# Altium schematic sheet Ethernet.SchDoc
size B; DocumentNumber: 8; SheetNumber: 8; SheetTotal: 13
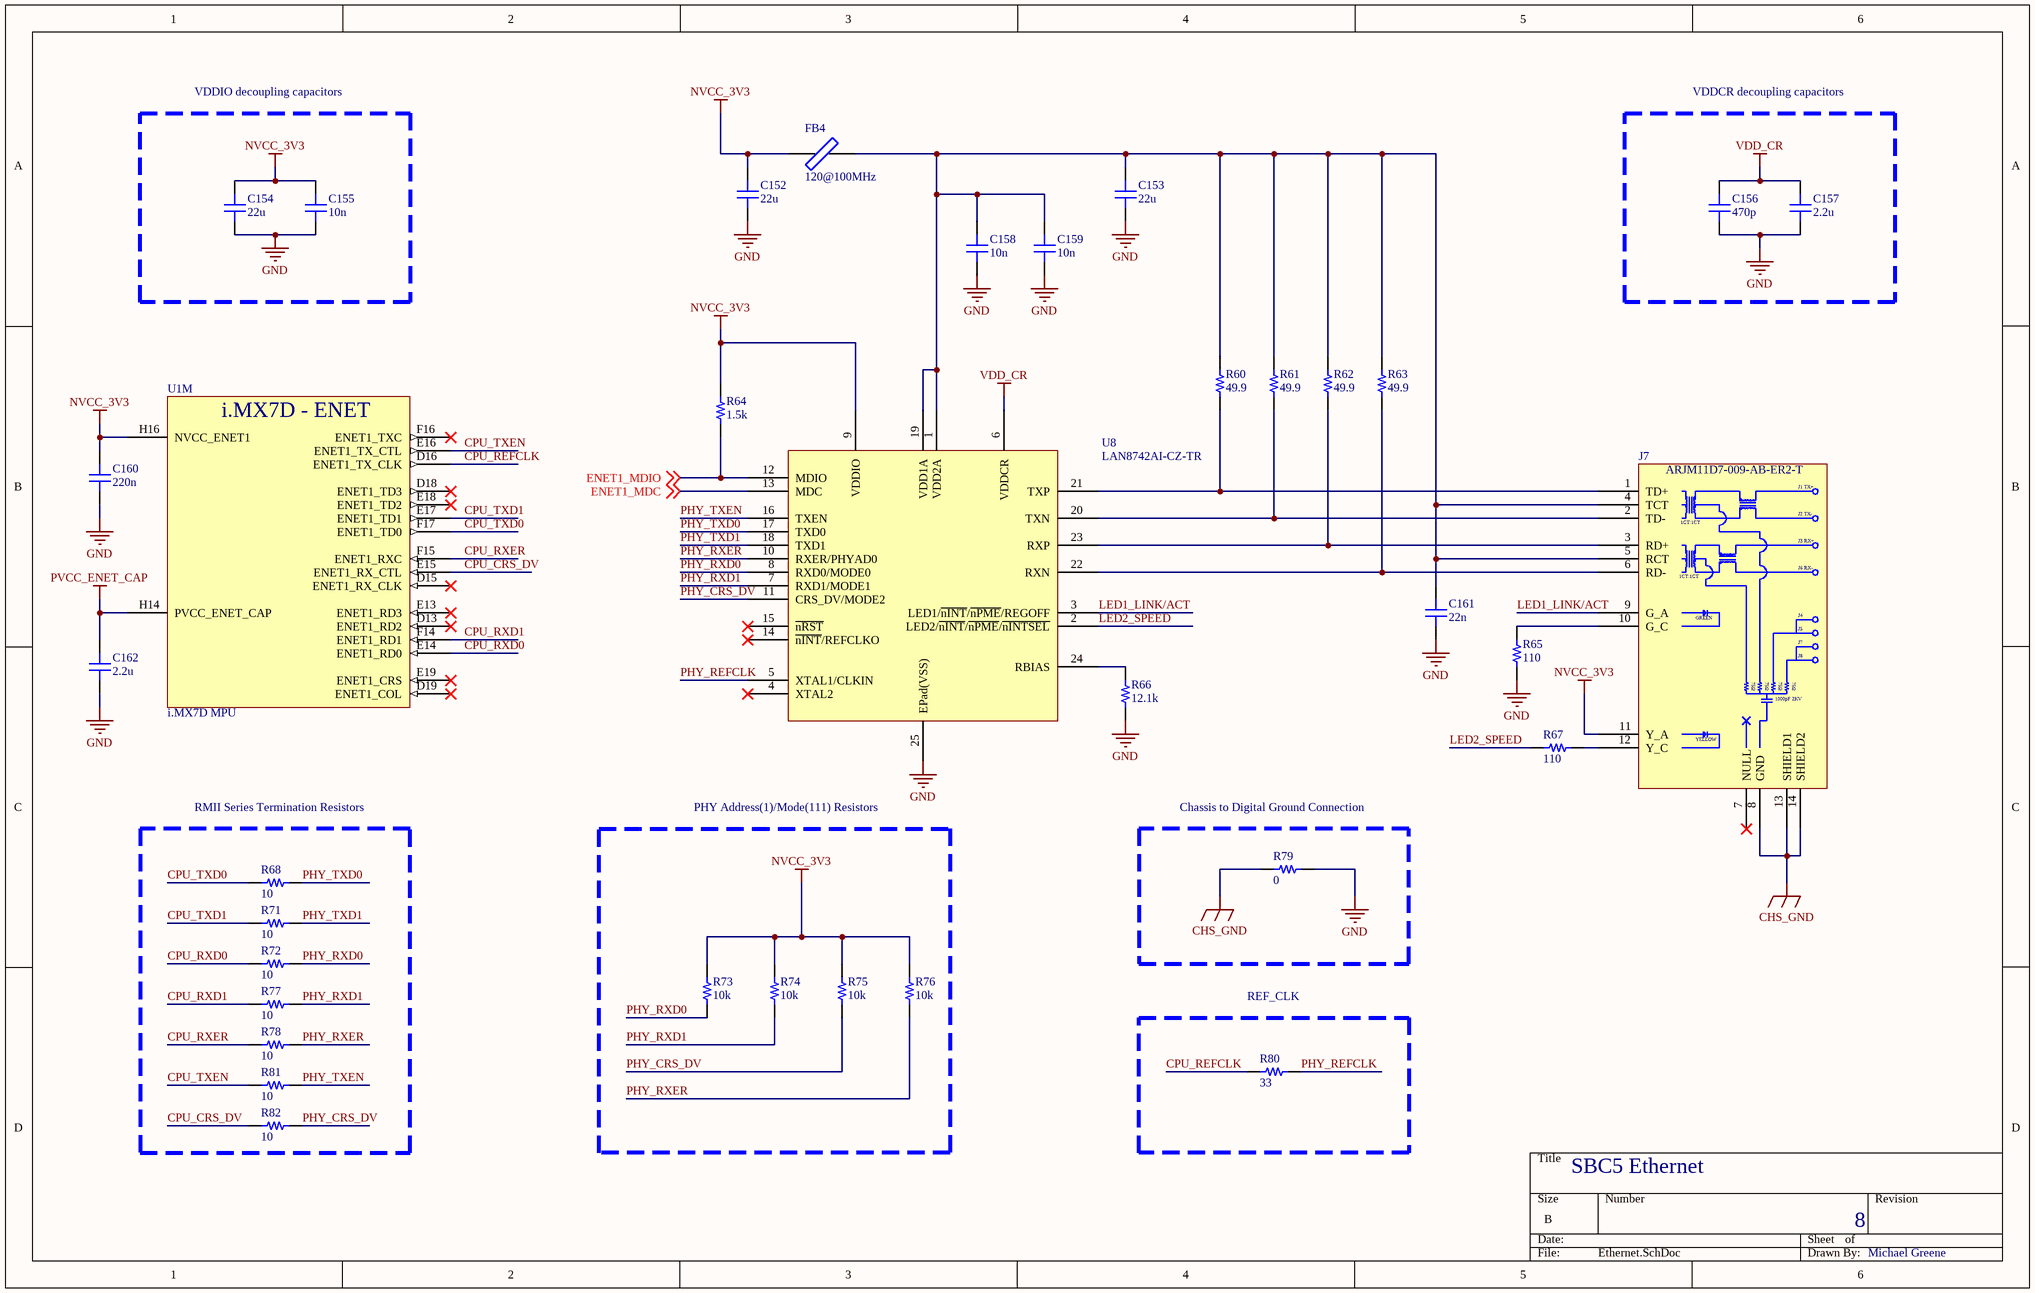
[diagram p0: Ethernet.SchDoc]

## Parts
C152  22u  [C0603]
C153  22u  [C0603]
C154  22u  [C0603]
C155  10n  [C0402]
C156  470p  [C0402]
C157  2.2u  [C0402]
C158  10n  [C0402]
C159  10n  [C0402]
C160  220n  [C0201]
C161  22n  [C0402]
C162  2.2u  [C0402]
FB4  120@100MHz  [L0402]
J7  ARJM11D7-009-AB-ER2-T  [ARJM11D7-009-AB-ER2-T]
R60  49.9  [R0402]
R61  49.9  [R0402]
R62  49.9  [R0402]
R63  49.9  [R0402]
R64  1.5k  [R0402]
R65  110  [R0402]
R66  12.1k  [R0402]
R67  110  [R0402]
R68  10  [R0402]
R71  10  [R0402]
R72  10  [R0402]
R73  10k  [R0201]
R74  10k  [R0201]
R75  10k  [R0201]
R76  10k  [R0201]
R77  10  [R0402]
R78  10  [R0402]
R79  0  [R1210]
R80  33  [R0402]
R81  10  [R0402]
R82  10  [R0402]
U1  i.MX7D MPU  [BGA541C75P25X25_1900X1900X140]  (part M of 23)
U8  LAN8742AI-CZ-TR  [LAN8742AI-CZ-TR-ND]

## Blocks framed on the sheet
VDDIO decoupling capacitors: C154 C155
VDDCR decoupling capacitors: C156 C157
RMII Series Termination Resistors: R68 R71 R72 R77 R78 R81 R82
PHY Address(1)/Mode(111) Resistors: R73-R76
Chassis to Digital Ground Connection: R79
REF_CLK: R80

## Nets
CHS_GND: J7.8(GND) J7.13(SHIELD1) J7.14(SHIELD2) R79.1
GND: C152.1 C153.1 C154.1 C155.1 C156.1 C157.1 C158.2 C159.1 C160.1 C161.1 C162.1 R65.1 R66.1 R79.2 U8.25(EPad(VSS))
NVCC_3V3: C152.2 C154.2 C155.2 C160.2 FB4.1 J7.11(Y_A) R64.2 R73.2 R74.2 R75.2 R76.2 U1.H16(NVCC_ENET1) U8.9(VDDIO)
PVCC_ENET_CAP: C162.2 U1.H14(PVCC_ENET_CAP)
VDD_CR: C156.2 C157.2 U8.6(VDDCR)
CPU_CRS_DV: R82.1 U1.E15(ENET1_RX_CTL)
CPU_REFCLK: R80.1 U1.D16(ENET1_TX_CLK)
CPU_RXD0: R72.1 U1.E14(ENET1_RD0)
CPU_RXD1: R77.1 U1.F14(ENET1_RD1)
CPU_RXER: R78.1 U1.F15(ENET1_RXC)
CPU_TXD0: R68.1 U1.F17(ENET1_TD0)
CPU_TXD1: R71.1 U1.E17(ENET1_TD1)
CPU_TXEN: R81.1 U1.E16(ENET1_TX_CTL)
ENET1_MDC: U8.13(MDC) ; off-sheet ENET1_MDC
ENET1_MDIO: R64.1 U8.12(MDIO) ; off-sheet ENET1_MDIO
LED1_LINK/ACT: J7.9(G_A) U8.3(LED1/~{nINT}/~{nPME}/REGOFF)
LED2_SPEED: R67.1 U8.2(LED2/~{nINT}/~{nPME}/~{nINTSEL})
PHY_CRS_DV: R75.1 R82.2 U8.11(CRS_DV/MODE2)
PHY_REFCLK: R80.2 U8.5(XTAL1/CLKIN)
PHY_RXD0: R72.2 R73.1 U8.8(RXD0/MODE0)
PHY_RXD1: R74.1 R77.2 U8.7(RXD1/MODE1)
PHY_RXER: R76.1 R78.2 U8.10(RXER/PHYAD0)
PHY_TXD0: R68.2 U8.17(TXD0)
PHY_TXD1: R71.2 U8.18(TXD1)
PHY_TXEN: R81.2 U8.16(TXEN)
NetC153_2: C153.2 C158.1 C159.2 C161.2 FB4.2 J7.4(TCT) J7.5(RCT) R60.2 R61.2 R62.2 R63.2 U8.1(VDD2A) U8.19(VDD1A)
NetJ7_1: J7.1(TD+) R60.1 U8.21(TXP)
NetJ7_2: J7.2(TD-) R61.1 U8.20(TXN)
NetJ7_3: J7.3(RD+) R62.1 U8.23(RXP)
NetJ7_6: J7.6(RD-) R63.1 U8.22(RXN)
NetJ7_10: J7.10(G_C) R65.2
NetJ7_12: J7.12(Y_C) R67.2
NetR66_2: R66.2 U8.24(RBIAS)

Not connected (* = marked no-connect by the designer): J7 7(NULL)*; U1 D13(ENET1_RD2)* D15(ENET1_RX_CLK)* D18(ENET1_TD3)* D19(ENET1_COL)* E13(ENET1_RD3)* E18(ENET1_TD2)* E19(ENET1_CRS)* F16(ENET1_TXC)*; U8 4(XTAL2)* 14(~{nINT}/REFCLKO)* 15(~{nRST})*

## Notes on the sheet
- SBC5 Ethernet
- 8
- Michael Greene
- (in symbol ARJM11D7-009-AB-ER2-T) J1 TX+; J2 TX-; 1CT:1CT; J3 RX+; J6 RX-; GREEN; J4; J5; J8; 75Ω; 1000pF 2KV; YELLOW
- (in symbol MCIMX7D2DVM12SD, part M) i.MX7D - ENET

## Library data of the parts
C152-C154 = GRM188R61A226ME15D: 0603 22 uF 10 V ±20% Tolerance X5R Multilayer Ceramic Chip Capacitor; Manufacturer: Murata; Capacitance: 22uF; Voltage Rating: 10V; Supplier 1: Digi-Key; Manufacturer Part Number: GRM188R61A226ME15D; RoHS: Yes; Category: Ceramic Capacitors; Stock 1: 1418007; Pricing 1: 1=0.30000, 10=0.20500, 50=0.13680, 100=0.11630, 500=0.08210, 1000=0.07184 (USD); Mount: Surface Mount; Case/Package: 0603; Case Code (Metric): 1608; Case Code (Imperial): 0603; Material: Ceramic; Weight: 0.000222oz; Min Operating Temperature: -55°C; Max Operating Temperature: 85°C; Tolerance: 20%; Packaging: Tape and Reel; Dielectric: X5R; Termination: SMD/SMT; Voltage Rating (DC): 10V; Package Quantity: 4000; Length: 1.6mm; Width: 0.8mm; Height: 0.8mm; Thickness: 0.039inch; Depth: 0.8mm; REACH SVHC: No SVHC; Lead Free: Lead Free; ComponentLink1URL: https://datasheet.ciiva.com/46444/1769893-46444975.pdf?src-supplier=Element14; ComponentLink1Description: https://datasheet.ciiva.com/46444/1769893-46444975.pdf?src-supplier=Element14; Supplier Part Number 1: 490-10476-1-ND
C155 C158 C159 = CL05B103KO5NNNC: SAMSUNG ELECTRO-MECHANICS - CL05B103KO5NNNC - SMD Multilayer Ceramic Capacitor, 0.01 µF, 16 V, 0402 [1005 Metric], ± 10%, X7R, CL Series; Capacitance: 10nF; Voltage Rating: 16V; Supplier 1: Digi-Key; Supplier Part Number 1: 1276-1051-1-ND; Manufacturer: Samsung; Manufacturer Part Number: CL05B103KO5NNNC; RoHS: Yes; Category: Ceramic Capacitors; Stock 1: 2979671; Pricing 1: 1=0.10000, 10=0.01600, 50=0.00880, 100=0.00710, 500=0.00508, 1000=0.00399, 2500=0.00363, 5000=0.00334 (USD); Mount: Surface Mount; Case/Package: 0402; Case Code (Metric): 1005; Case Code (Imperial): 0402; Material: Ceramic; Min Operating Temperature: -55°C; Max Operating Temperature: 125°C; Tolerance: 10%; Dielectric: X7R; Package Quantity: 1; Packaging: Tape and Reel; Voltage: 16V; Series: CL; Construction: Flat; Length: 1mm; Width: 0.02inch; Height: 0.5mm; Thickness: 0.022inch; Depth: 0.5mm; Radiation Hardening: No; RoHS Compliant: Yes; ComponentLink1URL: https://datasheet.ciiva.com/16199/cl05b103ko5nnnc-16199040.pdf?src-supplier=Future+Electronics; ComponentLink1Description: https://datasheet.ciiva.com/16199/cl05b103ko5nnnc-16199040.pdf?src-supplier=Future+Electronics; ComponentLink2URL: https://datasheet.ciiva.com/15195/getdatasheetpartid-358673-15195638.pdf?src-supplier=Verical; ComponentLink2Description: https://datasheet.ciiva.com/15195/getdatasheetpartid-358673-15195638.pdf?src-supplier=Verical; ComponentLink3URL: https://datasheet.ciiva.com/29198/458774-da-01-en-vs-kondensator-0402-29198435.pdf?src-supplier=Conrad; ComponentLink3Description: https://datasheet.ciiva.com/29198/458774-da-01-en-vs-kondensator-0402-29198435.pdf?src-supplier=Conrad; ComponentLink4URL: https://datasheet.ciiva.com/25806/cl05b103ko5nnnc-25806933.pdf?src-supplier=Digi-Key; ComponentLink4Description: https://datasheet.ciiva.com/25806/cl05b103ko5nnnc-25806933.pdf?src-supplier=Digi-Key
C156 = GRM1555C1H471JA01J: Multilayer Ceramic Capacitors MLCC - SMD/SMT 470pF 50Volts C0G 5%; Manufacturer: Murata; Voltage Rating: 50V; Supplier 1: Digi-Key; Supplier Part Number 1: 490-6242-1-ND; Manufacturer Part Number: GRM1555C1H471JA01J; RoHS: Yes; Category: Ceramic Capacitors; Stock 1: 130204; Pricing 1: 1=0.10000, 10=0.07100, 50=0.03900, 100=0.03180, 500=0.02272, 1000=0.01785, 2500=0.01622, 5000=0.01493 (USD); Mount: Surface Mount; Case/Package: 0402; Case Code (Metric): 1005; Case Code (Imperial): 0402; Min Operating Temperature: -55°C; Max Operating Temperature: 125°C; Capacitance: 470pF; Tolerance: 5%; Package Quantity: 50000; Packaging: Tape and Reel; Dielectric: C0G; Termination: SMD/SMT; Voltage: 50V; Voltage Rating (DC): 50V; Length: 1mm; Width: 0.02inch; Height: 0.5mm; Thickness: 0.022inch; Depth: 0.5mm; Radiation Hardening: No; Lead Free: Lead Free; ComponentLink1URL: https://datasheet.ciiva.com/6270/product-6270772.pdf?src-supplier=Digi-Key; ComponentLink1Description: https://datasheet.ciiva.com/6270/product-6270772.pdf?src-supplier=Digi-Key; ComponentLink2URL: https://datasheet.ciiva.com/6270/partnumbering-e-01-6270773.pdf?src-supplier=Digi-Key; ComponentLink2Description: https://datasheet.ciiva.com/6270/partnumbering-e-01-6270773.pdf?src-supplier=Digi-Key; ComponentLink3URL: https://datasheet.ciiva.com/6270/partnumbering-e-01-6270774.pdf?src-supplier=Digi-Key; ComponentLink3Description: https://datasheet.ciiva.com/6270/partnumbering-e-01-6270774.pdf?src-supplier=Digi-Key; ComponentLink4URL: https://datasheet.ciiva.com/11604/product-11604839.pdf?src-supplier=Avnet; ComponentLink4Description: https://datasheet.ciiva.com/11604/product-11604839.pdf?src-supplier=Avnet
C157 C162 = LMK105BJ225MV-F: TAIYO YUDEN         LMK105BJ225MV-F            CERAMIC CAPACITOR, 2.2UF, 10V, X5R, 20%, 0402; Supplier 1: Digi-Key; Manufacturer: Taiyo Yuden; Manufacturer Part Number: LMK105BJ225MV-F; RoHS: Yes; Category: Ceramic Capacitors; Stock 1: 422093; Pricing 1: 1=0.10000, 10=0.05800, 50=0.03160, 100=0.02590, 500=0.01848, 1000=0.01452, 2500=0.01320, 5000=0.01214 (USD); Mount: Surface Mount; Case/Package: 0402; Case Code (Imperial): 0402; Case Code (Metric): 1005; Min Operating Temperature: -55°C; Max Operating Temperature: 85°C; Termination: SMD/SMT; Packaging: Tape and Reel; Capacitance: 2.2uF; Tolerance: 20%; Voltage Rating: 10V; Package Quantity: 1; Voltage Rating (DC): 10V; Dielectric: X5R; Resistor Type: Ceramic; Length: 1mm; Width: 0.5mm; Height: 0.5mm; Thickness: 0.022inch; Depth: 0.5mm; Radiation Hardening: No; Halogen Free: Halogen Free; REACH SVHC: Unknown; ComponentLink1URL: https://datasheet.ciiva.com/30190/500lmk105bj225mv-f-30190498.pdf?src-supplier=Onlinecomponents.com; ComponentLink1Description: https://datasheet.ciiva.com/30190/500lmk105bj225mv-f-30190498.pdf?src-supplier=Onlinecomponents.com; ComponentLink2URL: https://datasheet.ciiva.com/23631/lmk105bj225mv-f-ss-23631491.pdf?src-supplier=Newark; ComponentLink2Description: https://datasheet.ciiva.com/23631/lmk105bj225mv-f-ss-23631491.pdf?src-supplier=Newark; ComponentLink3URL: https://datasheet.ciiva.com/134/lmk105bj225mv-f-ss-134677.pdf?src-supplier=Digi-Key; ComponentLink3Description: https://datasheet.ciiva.com/134/lmk105bj225mv-f-ss-134677.pdf?src-supplier=Digi-Key; ComponentLink4URL: https://datasheet.ciiva.com/15921/286lmk105bj225mv-f-15921222.pdf?src-supplier=Onlinecomponents.com; ComponentLink4Description: https://datasheet.ciiva.com/15921/286lmk105bj225mv-f-15921222.pdf?src-supplier=Onlinecomponents.com; Supplier Part Number 1: 587-3153-1-ND
C160 = GRM033R61C224KE14D: Cap Ceramic Monolithic 0.22uF 16VDC 10% SMD Paper T/R; Manufacturer: Murata; Supplier 1: Digi-Key; Manufacturer Part Number: GRM033R61C224KE14D; RoHS: No; Stock 1: 16192; Pricing 1: 1=0.10000, 10=0.03900, 50=0.02120, 100=0.01720, 500=0.01232, 1000=0.00968, 2500=0.00880, 5000=0.00810 (USD); ComponentLink1URL: https://search.murata.co.jp/Ceramy/image/img/A01X/G101/ENG/GRM033R61C224KE14-01.pdf?src-supplier=Digi-Key; ComponentLink1Description: https://search.murata.co.jp/Ceramy/image/img/A01X/G101/ENG/GRM033R61C224KE14-01.pdf?src-supplier=Digi-Key; Supplier Part Number 1: 490-17040-1-ND
C161 = GRM155R71H223KA12J: Multilayer Ceramic Capacitors MLCC - SMD/SMT 0.022uF 50Volts X7R 10%; Manufacturer: Murata; Capacitance: 22nF; Voltage Rating: 50V; Supplier 1: Digi-Key; Supplier Part Number 1: 490-6360-1-ND; Manufacturer Part Number: GRM155R71H223KA12J; RoHS: Yes; Category: Ceramic Capacitors; Stock 1: 8911; Pricing 1: 1=0.10000, 10=0.04300, 50=0.02320, 100=0.01900, 500=0.01356, 1000=0.01065, 2500=0.00968, 5000=0.00891 (USD); Mount: Surface Mount; Case/Package: 0402; Case Code (Imperial): 0402; Case Code (Metric): 1005; Min Operating Temperature: -55°C; Max Operating Temperature: 125°C; Voltage Rating (DC): 50V; Tolerance: 10%; Packaging: Tape and Reel; Package Quantity: 50000; Dielectric: X7R; Termination: SMD/SMT; Voltage: 50V; Length: 1mm; Width: 0.5mm; Height: 0.5mm; Thickness: 0.022inch; Depth: 0.5mm; Radiation Hardening: No; Lead Free: Lead Free; ComponentLink1URL: https://datasheet.ciiva.com/5421/product-5421874.pdf?src-supplier=Mouser; ComponentLink1Description: https://datasheet.ciiva.com/5421/product-5421874.pdf?src-supplier=Mouser; ComponentLink2URL: https://datasheet.ciiva.com/6271/partnumbering-e-01-6271031.pdf?src-supplier=Digi-Key; ComponentLink2Description: https://datasheet.ciiva.com/6271/partnumbering-e-01-6271031.pdf?src-supplier=Digi-Key; ComponentLink3URL: https://datasheet.ciiva.com/11619/product-11619562.pdf?src-supplier=Avnet; ComponentLink3Description: https://datasheet.ciiva.com/11619/product-11619562.pdf?src-supplier=Avnet; ComponentLink4URL: https://datasheet.ciiva.com/6271/partnumbering-e-01-6271033.pdf?src-supplier=Digi-Key; ComponentLink4Description: https://datasheet.ciiva.com/6271/partnumbering-e-01-6271033.pdf?src-supplier=Digi-Key; ComponentLink5URL: https://datasheet.ciiva.com/6271/partnumbering-e-01-6271036.pdf?src-supplier=Digi-Key; ComponentLink5Description: https://datasheet.ciiva.com/6271/partnumbering-e-01-6271036.pdf?src-supplier=Digi-Key
FB4 = BLM15PD121SN1D: MURATA - BLM15PD121SN1D - Ferrite Bead, 0402 [1005 Metric], 120 ohm, 1.3 A, BLM15PD Series, 0.09 ohm, ± 25%; Material: Steel,Ferrite; Impedance: 120R; DC Resistance (DCR): 90mR; Max DC Current: 1.3A; Number of Lines: 1; Test Frequency: 100MHz; Supplier 1: Digi-Key; Supplier Part Number 1: 490-5203-1-ND; Manufacturer: Murata; Manufacturer Part Number: BLM15PD121SN1D; RoHS: Yes; Category: Inductors; Stock 1: 519984; Pricing 1: 1=0.10000, 10=0.07900, 25=0.07080, 50=0.05180, 100=0.04480, 250=0.03536, 500=0.02984, 1000=0.02514, 5000=0.02239 (USD); Case/Package: 0402; Number of Pins: 2; Core Material: Ferrite; Case Code (Metric): 1005; Case Code (Imperial): 0402; Min Operating Temperature: -55°C; Max Operating Temperature: 125°C; Tolerance: 25%; Package Quantity: 1; Packaging: Tape and Reel; Current Rating: 1.3A; Max Current Rating: 1.3A; Termination: SMD/SMT; DC Current: 1.3A; Number of Circuits: 1; Series: BLM15PD; DC Resistance-Max: 90mR; Length: 1mm; Width: 0.5mm; Height: 0.5mm; Depth: 0.55mm; Radiation Hardening: No; REACH SVHC: No SVHC; Military Standard: Not; Lead Free: Lead Free; RoHS Compliant: Yes; ComponentLink1URL: https://datasheet.ciiva.com/18093/getdatasheetpartid-195858-18093157.pdf?src-supplier=Verical; ComponentLink1Description: https://datasheet.ciiva.com/18093/getdatasheetpartid-195858-18093157.pdf?src-supplier=Verical; ComponentLink2URL: https://datasheet.ciiva.com/11800/0900766b811b5866-11800860.pdf?src-supplier=RSComponents; ComponentLink2Description: https://datasheet.ciiva.com/11800/0900766b811b5866-11800860.pdf?src-supplier=RSComponents; ComponentLink3URL: https://datasheet.ciiva.com/41425/001171686-da-01-en-chip-drossel0402-120r-1300ma-1-0x0-5mm-41425776.pdf?src-supplier=Conrad; ComponentLink3Description: https://datasheet.ciiva.com/41425/001171686-da-01-en-chip-drossel0402-120r-1300ma-1-0x0-5mm-41425776.pdf?src-supplier=Conrad; ComponentLink4URL: https://datasheet.ciiva.com/41449/001172205-da-01-en-drossel-0402-120r-11-0x0-5mm-10000st-41449495.pdf?src-supplier=Conrad; ComponentLink4Description: https://datasheet.ciiva.com/41449/001172205-da-01-en-drossel-0402-120r-11-0x0-5mm-10000st-41449495.pdf?src-supplier=Conrad; ComponentLink5URL: https://datasheet.ciiva.com/1012/l0110e-1012434.pdf?src-supplier=Digi-Key; ComponentLink5Description: https://datasheet.ciiva.com/1012/l0110e-1012434.pdf?src-supplier=Digi-Key; ComponentLink6URL: https://datasheet.ciiva.com/1012/l0110e-1012435.pdf?src-supplier=Digi-Key; ComponentLink6Description: https://datasheet.ciiva.com/1012/l0110e-1012435.pdf?src-supplier=Digi-Key; ComponentLink7URL: https://datasheet.ciiva.com/1012/l0110e-1012436.pdf?src-supplier=Digi-Key; ComponentLink7Description: https://datasheet.ciiva.com/1012/l0110e-1012436.pdf?src-supplier=Digi-Key
J7 = ARJM11D7-009-AB-ER2-T: Conn RJ-45 F 8 POS 1.27mm Solder RA Thru-Hole 12 Terminal 1 Port T/R; Manufacturer: Abracon; Connector Type: RJ45; Direction: Up; Number of Ports: 1; Number of Cores per Jack: 4; Shielding: Shielded; Supplier 1: Digi-Key; Supplier Part Number 1: 535-14135-1-ND; Manufacturer Part Number: ARJM11D7-009-AB-ER2-T; RoHS: No; Category: Modular / Ethernet Connectors; Stock 1: 19; Pricing 1: 1=3.53000, 10=3.38700, 25=3.10480 (USD); Mount: Through Hole; Color: Green,Yellow; Contact Plating: Gold; Min Operating Temperature: -40°C; Max Operating Temperature: 85°C; Packaging: Tape and Reel; Number of Rows: 1; Termination: Solder; ComponentLink1URL: https://abracon.com/Magnetics/ARJM11.pdf?src-supplier=Digi-Key; ComponentLink1Description: https://abracon.com/Magnetics/ARJM11.pdf?src-supplier=Digi-Key
R60-R63 = MCS04020C4999FE000: RES SMD 49.9 OHM 1% 1/10W 0402; Manufacturer: Vishay BCcomponents; Temperature Coefficient: 50ppm/°C; Resistance: 49.9R; Max Power Dissipation: 100mW; Power Rating: 63mW; Voltage Rating: 50V; Supplier 1: Digi-Key; Supplier Part Number 1: 749-1585-1-ND; Manufacturer Part Number: MCS04020C4999FE000; RoHS: Yes; Category: Chip SMD Resistors; Stock 1: 27900; Pricing 1: 1=0.26000, 10=0.22000, 100=0.08600, 1000=0.03600, 2500=0.03300, 5000=0.03000 (USD); Case/Package: 0402; Contact Plating: Tin; Weight: 2.3E-05oz; Case Code (Imperial): 0402; Case Code (Metric): 1005; Min Operating Temperature: -55°C; Max Operating Temperature: 125°C; Tolerance: 1%; Resistor Type: Thin Film; Packaging: Tape and Reel; Package Quantity: 10000; Termination: SMD/SMT; Number of Terminations: 2; Length: 1mm; Width: 0.5mm; Height: 0.015inch; Depth: 0.5mm; Radiation Hardening: No; Military Standard: Not; Lead Free: Lead Free; ComponentLink1URL: https://datasheet.ciiva.com/2575/mc-pro-2575459.pdf?src-supplier=Digi-Key; ComponentLink1Description: https://datasheet.ciiva.com/2575/mc-pro-2575459.pdf?src-supplier=Digi-Key; ComponentLink2URL: https://datasheet.ciiva.com/8900/mc-pro-8900101.pdf?src-supplier=Avnet; ComponentLink2Description: https://datasheet.ciiva.com/8900/mc-pro-8900101.pdf?src-supplier=Avnet; ComponentLink3URL: https://datasheet.ciiva.com/16892/mc-pro-16892870.pdf?src-supplier=Avnet+Europe; ComponentLink3Description: https://datasheet.ciiva.com/16892/mc-pro-16892870.pdf?src-supplier=Avnet+Europe
R64 = RMCF0402FT1K50: RES 1.5K OHM 1% 1/16W 0402; Manufacturer: Stackpole Electronics; Resistance: 1.5kR; Power Rating: 62.5mW; Max Power Dissipation: 63mW; Temperature Coefficient: 100ppm/°C; Supplier 1: Digi-Key; Supplier Part Number 1: RMCF0402FT1K50CT-ND; Manufacturer Part Number: RMCF0402FT1K50; RoHS: Yes; Category: Chip SMD Resistors; Stock 1: 378149; Pricing 1: 1=0.10000, 10=0.01300, 100=0.00530, 1000=0.00239, 2500=0.00207, 5000=0.00171 (USD); Mount: Surface Mount; Case/Package: 0402; Case Code (Imperial): 0402; Contact Plating: Tin,Matte; Case Code (Metric): 1005; Min Operating Temperature: -55°C; Max Operating Temperature: 155°C; Tolerance: 1%; Packaging: Tape and Reel; Resistor Type: Thick Film; Number of Terminations: 2; Features: Automotive AEC-Q200; Length: 0.039inch; Width: 0.02inch; Height: 0.016inch; Radiation Hardening: No; Lead Free: Lead Free; ComponentLink1URL: http://components.arrow.com/part/dataview/44988063S7520342N1174?src-supplier=Arrow+Electronics; ComponentLink1Description: http://components.arrow.com/part/dataview/44988063S7520342N1174?src-supplier=Arrow+Electronics; ComponentLink2URL: https://www.seielect.com/catalog/SEI-Packaging.pdf?src-supplier=Digi-Key; ComponentLink2Description: https://www.seielect.com/catalog/SEI-Packaging.pdf?src-supplier=Digi-Key; ComponentLink3URL: https://www.seielect.com/catalog/SEI-RMCF_RMCP.pdf?src-supplier=Avnet+Asia; ComponentLink3Description: https://www.seielect.com/catalog/SEI-RMCF_RMCP.pdf?src-supplier=Avnet+Asia; ComponentLink4URL: https://www.seielect.com/catalog/SEI-RMCF_RMCP.pdf?src-supplier=Avnet; ComponentLink4Description: https://www.seielect.com/catalog/SEI-RMCF_RMCP.pdf?src-supplier=Avnet
R65 R67 = RMCF0402FT110R: Res Thick Film 0402 110 Ohm 1% 0.063W(1/16W) ±100ppm/C Pad SMD Automotive T/R; Manufacturer: Stackpole Electronics; Resistance: 110R; Max Power Dissipation: 63mW; Temperature Coefficient: 100ppm/°C; Supplier 1: Digi-Key; Supplier Part Number 1: RMCF0402FT110RCT-ND; Manufacturer Part Number: RMCF0402FT110R; RoHS: Yes; Category: Chip SMD Resistors; Stock 1: 98158; Pricing 1: 1=0.10000, 10=0.01300, 100=0.00530, 1000=0.00239, 2500=0.00207, 5000=0.00171 (USD); Mount: Surface Mount; Case/Package: 0402; Case Code (Metric): 1005; Case Code (Imperial): 0402; Contact Plating: Tin,Matte; Min Operating Temperature: -55°C; Max Operating Temperature: 155°C; Packaging: Tape and Reel; Tolerance: 1%; Package Quantity: 1; Resistor Type: Thick Film; Number of Terminations: 2; Features: Automotive AEC-Q200; Series: RMCF; Length: 0.039inch; Width: 0.02inch; Height: 0.016inch; Lead Free: Lead Free; RoHS Compliant: Yes; ComponentLink1URL: https://www.seielect.com/Catalog/SEI-RMCF_RMCP.pdf?src-supplier=Avnet; ComponentLink1Description: https://www.seielect.com/Catalog/SEI-RMCF_RMCP.pdf?src-supplier=Avnet; ComponentLink2URL: https://www.seielect.com/Catalog/SEI-RMCF_RMCP.pdf?src-supplier=Digi-Key; ComponentLink2Description: https://www.seielect.com/Catalog/SEI-RMCF_RMCP.pdf?src-supplier=Digi-Key; ComponentLink3URL: https://www.seielect.com/catalog/SEI-Packaging.pdf?src-supplier=Digi-Key; ComponentLink3Description: https://www.seielect.com/catalog/SEI-Packaging.pdf?src-supplier=Digi-Key
R66 = RK73H1ETTP1212F: Res Thick Film 0402 12.1K Ohm 1% 0.063W ±100ppm/°C Molded SMD Punched Paper T/R; Manufacturer: KOA Speer; Resistance: 12.1kR; Power Rating: 63mW; Voltage Rating: 50V; Supplier 1: Digi-Key; Supplier Part Number 1: 2019-RK73H1ETTP1212FCT-ND; Manufacturer Part Number: RK73H1ETTP1212F; RoHS: Yes; Category: Chip SMD Resistors; Stock 1: 203450; Pricing 1: 1=0.10000, 10=0.02200, 100=0.00890, 1000=0.00398, 2500=0.00345, 5000=0.00285 (USD); Mount: Surface Mount; Case/Package: 0402; Case Code (Imperial): 0402; Case Code (Metric): 1005; Min Operating Temperature: -55°C; Max Operating Temperature: 155°C; Tolerance: 1%; Packaging: Tape and Reel; Package Quantity: 10000; Resistor Type: Thick Film; Termination: SMD/SMT; Temperature Coefficient: 100ppm/°C; Voltage Rating (DC): 50V; Length: 1mm; Width: 0.5mm; Height: 0.35mm; Depth: 0.5mm; Military Standard: Not; Lead Free: Lead Free; ComponentLink1URL: https://datasheet.ciiva.com/5555/rk73h-5555974.pdf?src-supplier=Mouser; ComponentLink1Description: https://datasheet.ciiva.com/5555/rk73h-5555974.pdf?src-supplier=Mouser
R68 R71 R72 R77 R78 R81 R82 = RMCF0402FT10R0: RES 10 OHM 1% 1/16W 0402; Manufacturer: Stackpole Electronics; Resistance: 10R; Power Rating: 63mW; Temperature Coefficient: 100ppm/°C; Supplier 1: Digi-Key; Supplier Part Number 1: RMCF0402FT10R0CT-ND; Manufacturer Part Number: RMCF0402FT10R0; RoHS: Yes; Category: Chip SMD Resistors; Stock 1: 588325; Pricing 1: 1=0.10000, 10=0.01300, 100=0.00530, 1000=0.00239, 2500=0.00207, 5000=0.00171 (USD); Mount: Surface Mount; Case/Package: 0402; Contact Plating: Tin,Matte; Case Code (Imperial): 0402; Case Code (Metric): 1005; Min Operating Temperature: -55°C; Max Operating Temperature: 155°C; Tolerance: 1%; Packaging: Tape and Reel; Max Power Dissipation: 63mW; Features: Automotive AEC-Q200; Resistor Type: Thick Film; Number of Terminations: 2; Length: 1mm; Width: 0.02inch; Height: 0.016inch; Depth: 0.5mm; Radiation Hardening: No; Lead Free: Lead Free; Military Standard: Not; ComponentLink1URL: http://components.arrow.com/part/dataview/44988361S6966751N1174?src-supplier=Arrow+Electronics; ComponentLink1Description: http://components.arrow.com/part/dataview/44988361S6966751N1174?src-supplier=Arrow+Electronics; ComponentLink2URL: https://www.seielect.com/catalog/SEI-RMCF_RMCP.pdf?src-supplier=Avnet; ComponentLink2Description: https://www.seielect.com/catalog/SEI-RMCF_RMCP.pdf?src-supplier=Avnet; ComponentLink3URL: https://www.seielect.com/catalog/SEI-Packaging.pdf?src-supplier=Digi-Key; ComponentLink3Description: https://www.seielect.com/catalog/SEI-Packaging.pdf?src-supplier=Digi-Key; ComponentLink4URL: http://www.seielect.com/Catalog/SEI-RMCF_RMCP.pdf?src-supplier=Future+Electronics; ComponentLink4Description: http://www.seielect.com/Catalog/SEI-RMCF_RMCP.pdf?src-supplier=Future+Electronics
R73-R76 = RMCF0201FT10K0: RES 10K OHM 1% 1/20W 0201; Manufacturer: Stackpole Electronics; Max Power Dissipation: 50mW; Temperature Coefficient: 200ppm/°C; Resistance: 10kR; Supplier 1: Digi-Key; Manufacturer Part Number: RMCF0201FT10K0; RoHS: Yes; Category: Chip SMD Resistors; Stock 1: 1526173; Pricing 1: 1=0.10000, 10=0.02300, 100=0.00940, 1000=0.00424, 2500=0.00368, 5000=0.00304 (USD); Mount: Surface Mount; Case/Package: 0201; Contact Plating: Tin,Matte; Case Code (Imperial): 0201; Case Code (Metric): 0603; Min Operating Temperature: -55°C; Max Operating Temperature: 125°C; Resistor Type: Thick Film; Number of Terminations: 2; Packaging: Tape and Reel; Tolerance: 1%; Power Rating: 50mW; Length: 0.024inch; Width: 0.012inch; Height: 0.009inch; ComponentLink1URL: https://www.seielect.com/catalog/SEI-Packaging.pdf?src-supplier=Digi-Key; ComponentLink1Description: https://www.seielect.com/catalog/SEI-Packaging.pdf?src-supplier=Digi-Key; ComponentLink2URL: https://www.seielect.com/Catalog/SEI-RMCF_RMCP.pdf?src-supplier=Avnet+Asia; ComponentLink2Description: https://www.seielect.com/Catalog/SEI-RMCF_RMCP.pdf?src-supplier=Avnet+Asia; ComponentLink3URL: https://www.seielect.com/Catalog/SEI-RMCF_RMCP.pdf?src-supplier=Avnet; ComponentLink3Description: https://www.seielect.com/Catalog/SEI-RMCF_RMCP.pdf?src-supplier=Avnet; ComponentLink4URL: https://www.seielect.com/Catalog/SEI-RMCF_RMCP.pdf?src-supplier=Digi-Key; ComponentLink4Description: https://www.seielect.com/Catalog/SEI-RMCF_RMCP.pdf?src-supplier=Digi-Key; Supplier Part Number 1: RMCF0201FT10K0CT-ND
R79 = RMCF1210ZT0R00: RES 0.0 OHM 1/2W 1210 SMD; Manufacturer: Stackpole Electronics; Resistance: 0mR; Power Rating: 330mW; Max Power Dissipation: 500mW; Tolerance: 1%; Supplier 1: Digi-Key; Supplier Part Number 1: RMCF1210ZT0R00CT-ND; Manufacturer Part Number: RMCF1210ZT0R00; RoHS: Yes; Category: Chip SMD Resistors; Stock 1: 487458; Pricing 1: 1=0.10000, 10=0.09100, 25=0.06320, 50=0.04900, 100=0.03500, 250=0.02732, 500=0.02170, 1000=0.01540 (USD); Mount: Surface Mount; Case/Package: 1210; Case Code (Metric): 3225; Contact Plating: Tin,Matte; Case Code (Imperial): 1210; Min Operating Temperature: -55°C; Max Operating Temperature: 155°C; Packaging: Tape and Reel; Resistor Type: Thick Film; Number of Terminations: 2; Features: Automotive AEC-Q200; Length: 0.126inch; Width: 0.098inch; Height: 0.028inch; Radiation Hardening: No; Lead Free: Lead Free; ComponentLink1URL: https://www.seielect.com/Catalog/SEI-RMCF_RMCP.pdf?src-supplier=Digi-Key; ComponentLink1Description: https://www.seielect.com/Catalog/SEI-RMCF_RMCP.pdf?src-supplier=Digi-Key; ComponentLink2URL: https://www.seielect.com/catalog/SEI-RMCF_RMCP.pdf?src-supplier=Avnet; ComponentLink2Description: https://www.seielect.com/catalog/SEI-RMCF_RMCP.pdf?src-supplier=Avnet
R80 = RMCF0402FT33R0: RES 33 OHM 1% 1/16W 0402; Manufacturer: Stackpole Electronics; Resistance: 33R; Max Power Dissipation: 63mW; Temperature Coefficient: 100ppm/°C; Supplier 1: Digi-Key; Supplier Part Number 1: RMCF0402FT33R0CT-ND; Manufacturer Part Number: RMCF0402FT33R0; RoHS: Yes; Category: Chip SMD Resistors; Stock 1: 993457; Pricing 1: 1=0.10000, 10=0.01300, 100=0.00530, 1000=0.00239, 2500=0.00207, 5000=0.00171 (USD); Mount: Surface Mount; Case/Package: 0402; Case Code (Metric): 1005; Case Code (Imperial): 0402; Contact Plating: Tin,Matte; Min Operating Temperature: -55°C; Max Operating Temperature: 155°C; Features: Automotive AEC-Q200; Package Quantity: 1; Resistor Type: Thick Film; Number of Terminations: 2; Packaging: Tape and Reel; Tolerance: 1%; Length: 0.039inch; Width: 0.02inch; Height: 0.016inch; Radiation Hardening: No; Lead Free: Lead Free; ComponentLink1URL: https://www.seielect.com/catalog/SEI-RMCF_RMCP.pdf?src-supplier=Avnet; ComponentLink1Description: https://www.seielect.com/catalog/SEI-RMCF_RMCP.pdf?src-supplier=Avnet; ComponentLink2URL: https://www.seielect.com/catalog/SEI-Packaging.pdf?src-supplier=Digi-Key; ComponentLink2Description: https://www.seielect.com/catalog/SEI-Packaging.pdf?src-supplier=Digi-Key; ComponentLink3URL: https://www.seielect.com/Catalog/SEI-RMCF_RMCP.pdf?src-supplier=Digi-Key; ComponentLink3Description: https://www.seielect.com/Catalog/SEI-RMCF_RMCP.pdf?src-supplier=Digi-Key
U1 = MCIMX7D2DVM12SD: Heterogeneous Multicore Processing Architecture; Manufacturer: NXP Freescale; Manufacturer Part Number: MCIMX7D2DVM12SD; Stock 1: 0; Pricing 1: 168=18.42238 (USD); ComponentLink1Description: Datasheet; ComponentLink1URL: https://www.nxp.com/docs/en/data-sheet/IMX7DCEC.pdf; ComponentLink2Description: Reference manual; ComponentLink2URL: https://www.nxp.com/docs/en/reference-manual/IMX7DRM.pdf; ComponentLink3Description: Hardware Development Guide; ComponentLink3URL: https://www.nxp.com/docs/en/user-guide/IMX7DSHDG.pdf; Supplier 1: Digi-Key; Supplier Part Number 1: 568-15401-ND
U8 = LAN8742AI-CZ-TR: MICROCHIP - LAN8742AI-CZ-TR - Ethernet Controller, 100 Mbps, IEEE 802.3, IEEE 802.3u, 1.62 V, 3.6 V, SQFN, 24 Pins; Max Supply Voltage: 3.3V; Min Supply Voltage: 1.8V; Number of Transceivers: 1; Simplex/Duplex: Full Duplex; Supplier 1: Digi-Key; Supplier Part Number 1: LAN8742AI-CZ-CT-ND; Manufacturer: Microchip; Manufacturer Part Number: LAN8742AI-CZ-TR; RoHS: Yes; Category: Ethernet Interface ICs; Stock 1: 6788; Pricing 1: 1=1.49000, 25=1.24000, 100=1.15200 (USD); Mount: Surface Mount; Case/Package: QFN; Number of Pins: 24; Min Operating Temperature: -40°C; Max Operating Temperature: 85°C; Data Rate: 100Mbps; Packaging: Tape and Reel; Package Quantity: 5000; Radiation Hardening: No; ComponentLink1URL: https://datasheet.ciiva.com/18624/00001539a-18624796.pdf?src-supplier=Digi-Key; ComponentLink1Description: https://datasheet.ciiva.com/18624/00001539a-18624796.pdf?src-supplier=Digi-Key; ComponentLink2URL: https://datasheet.ciiva.com/29882/8742a-29882621.pdf?src-supplier=Avnet; ComponentLink2Description: https://datasheet.ciiva.com/29882/8742a-29882621.pdf?src-supplier=Avnet; Supplier 2: Arrow Electronics; Supplier Part Number 2: LAN8742AI-CZ-TR; Supplier 3: Newark; Supplier Part Number 3: 41AH8416; Supplier 4: Avnet; Supplier Part Number 4: 41AH8416